# Altium project Room1.PrjPCB
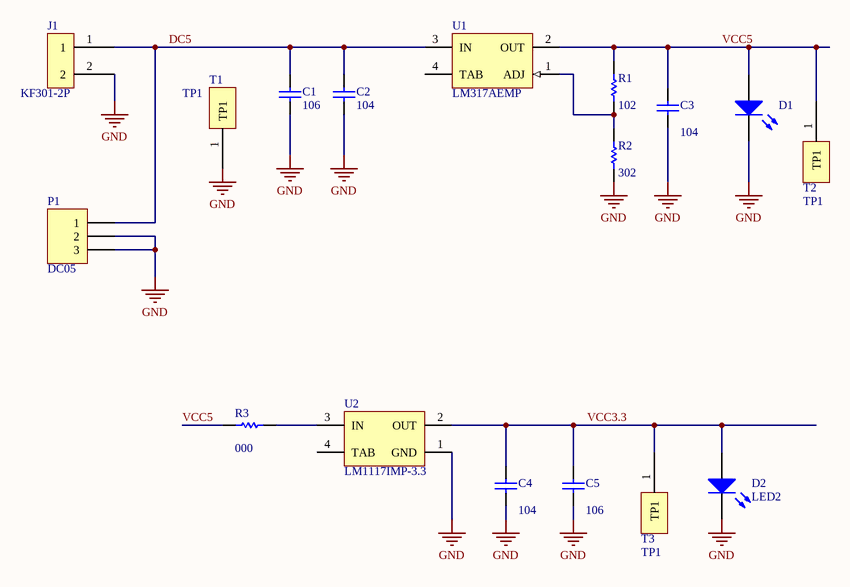
[diagram p0: Power1.SchDoc]
3 sheets, 42 parts. Net scope: global (net labels, ports and power ports of the same name join across sheets).
Board file: Room1.PcbDoc
Sheets:
  Power1.SchDoc
  STM32F103.SchDoc
  Raspi.SchDoc

## Sheet Power1.SchDoc
size A4

### Parts
C1  value 106  [CAPC3216L]  (hidden comment: Cap Semi)
C2  value 104  [CAPC3216L]  (hidden comment: Cap Semi)
C3  value 104  [CAPC3216L]  (hidden comment: Cap Semi)
C4  value 104  [CAPC3216L]  (hidden comment: Cap Semi)
C5  value 106  [CAPC3216L]  (hidden comment: Cap Semi)
D1  LED0  [CAPC2512L]  (value not drawn)
D2  LED2  [CAPC2512L]
J1  KF301-2P  [KF301-2P]
P1  DC05  [DC005]
R1  value 102  [RESC3216L]  (hidden comment: Res Semi)
R2  value 302  [RESC3216L]  (hidden comment: Res Semi)
R3  value 000  [RESC3216L]  (hidden comment: Res Semi)
T1  TP1  [TP1]
T2  TP1  [TP1]
T3  TP1  [TP1]
U1  LM317AEMP  [MP04A_L]
U2  LM1117IMP-3.3  [MP04A_N]

### Nets
GND: C1.1 C2.1 C3.1 C4.1 C5.1 D1.2(K) D2.2(K) J1.2 P1.2 P1.3 R2.1 T1.1(TP1) U2.1(GND)
DC5: C1.2 C2.2 J1.1 P1.1 U1.3(IN)
VCC3.3: C4.2 C5.2 D2.1(A) T3.1(TP1) U2.2(OUT)
VCC5: C3.2 D1.1(A) R1.2 R3.1 T2.1(TP1) U1.2(OUT)
NetR1_1: R1.1 R2.2 U1.1(ADJ)
NetR3_2: R3.2 U2.3(IN)

Not connected (* = marked no-connect by the designer): U1 4(TAB); U2 4(TAB)

### Library data of the parts
C1-C5 = Cap Semi: Capacitor (Semiconductor SIM Model); Published: 8-Jun-2000; LatestRevisionDate: 29-May-2009; LatestRevisionNote: IPC-7351 Footprint Added.; PackageReference: C1206; Publisher: Altium Limited; PackageDescription: Chip Capacitor
D1 = LED0: Typical INFRARED GaAs LED; Published: 8-Jun-2000; LatestRevisionDate: 08-Jul-2005; LatestRevisionNote: Mech Layer 1 removed.; PackageReference: LED-0; Publisher: Altium Limited
D2 = LED2: Typical RED, GREEN, YELLOW, AMBER GaAs LED; Published: 8-Jun-2000; LatestRevisionDate: 17-Jul-2002; LatestRevisionNote: Re-released for DXP Platform.; PackageVersion: Feb-2002; PackageReference: 3.2X1.6X1.1; Publisher: Altium Limited
P1 = Header 3: Header, 3-Pin; LatestRevisionDate: 17-Jul-2002; LatestRevisionNote: Re-released for DXP Platform.; Publisher: Altium Limited
R1-R3 = Res Semi: Semiconductor Resistor; Published: 8-Jun-2000; LatestRevisionDate: 17-Jul-2002; LatestRevisionNote: Re-released for DXP Platform.; PackageReference: AXIAL-0.5; Publisher: Altium Limited
U1 = LM317AEMP: 3-Terminal Adjustable Regulator; Manufacturer: National Semiconductor; CompType: LDO IC; PackageTopMarking: XYTT*N07A; PowerWise: N; Published: 4-Dec-2008; DatasheetVersion: Apr-2007; PackageVersion: revB, Apr-2003; PackageReference: MP04A; Publisher: Altium Limited; PackageDescription: Molded SOT-223, 6.50 x 3.56 x 1.6mm Body, 4 Lead, 2.3mm Pitch; PartNumber: LM317AEMP; RoHS: O; PinCount: 4; DigiKeyPartNumber: LM317AEMPCT-ND; Code_JEDEC: TO-261-AA; Code_IPC: SOT223-4; ComponentLink1Description: LM317 Datasheet; ComponentLink1URL: http://www.national.com/ds/LM/LM317.pdf; ComponentLink2Description: LM317 Web Page; ComponentLink2URL: http://www.national.com/pf/LM/LM317.html; ComponentLink3Description: MP04A Package Page; ComponentLink3URL: http://www.national.com/packaging/folders/mp04a.html
U2 = LM1117IMP-3.3: 800mA Low-Dropout Linear Regulator; Manufacturer: National Semiconductor; CompType: LDO IC; PackageTopMarking: XYTT*N05B; PowerWise: N; Published: 4-Dec-2008; DatasheetVersion: Apr-2006; PackageVersion: revB, Apr-2003; PackageReference: MP04A; Publisher: Altium Limited; PackageDescription: Molded SOT-223, 6.50 x 3.56 x 1.6mm Body, 4 Lead, 2.3mm Pitch; PartNumber: LM1117IMP-3.3; RoHS: O; PinCount: 4; DigiKeyPartNumber: LM1117IMP-3.3CT-ND; Code_JEDEC: TO-261-AA; Code_IPC: SOT223-4; ComponentLink1Description: LM1117 Datasheet; ComponentLink1URL: http://www.national.com/ds/LM/LM1117.pdf; ComponentLink2Description: LM1117 Web Page; ComponentLink2URL: http://www.national.com/pf/LM/LM1117.html; ComponentLink3Description: MP04A Package Page; ComponentLink3URL: http://www.national.com/packaging/folders/mp04a.html

## Sheet STM32F103.SchDoc
size A4
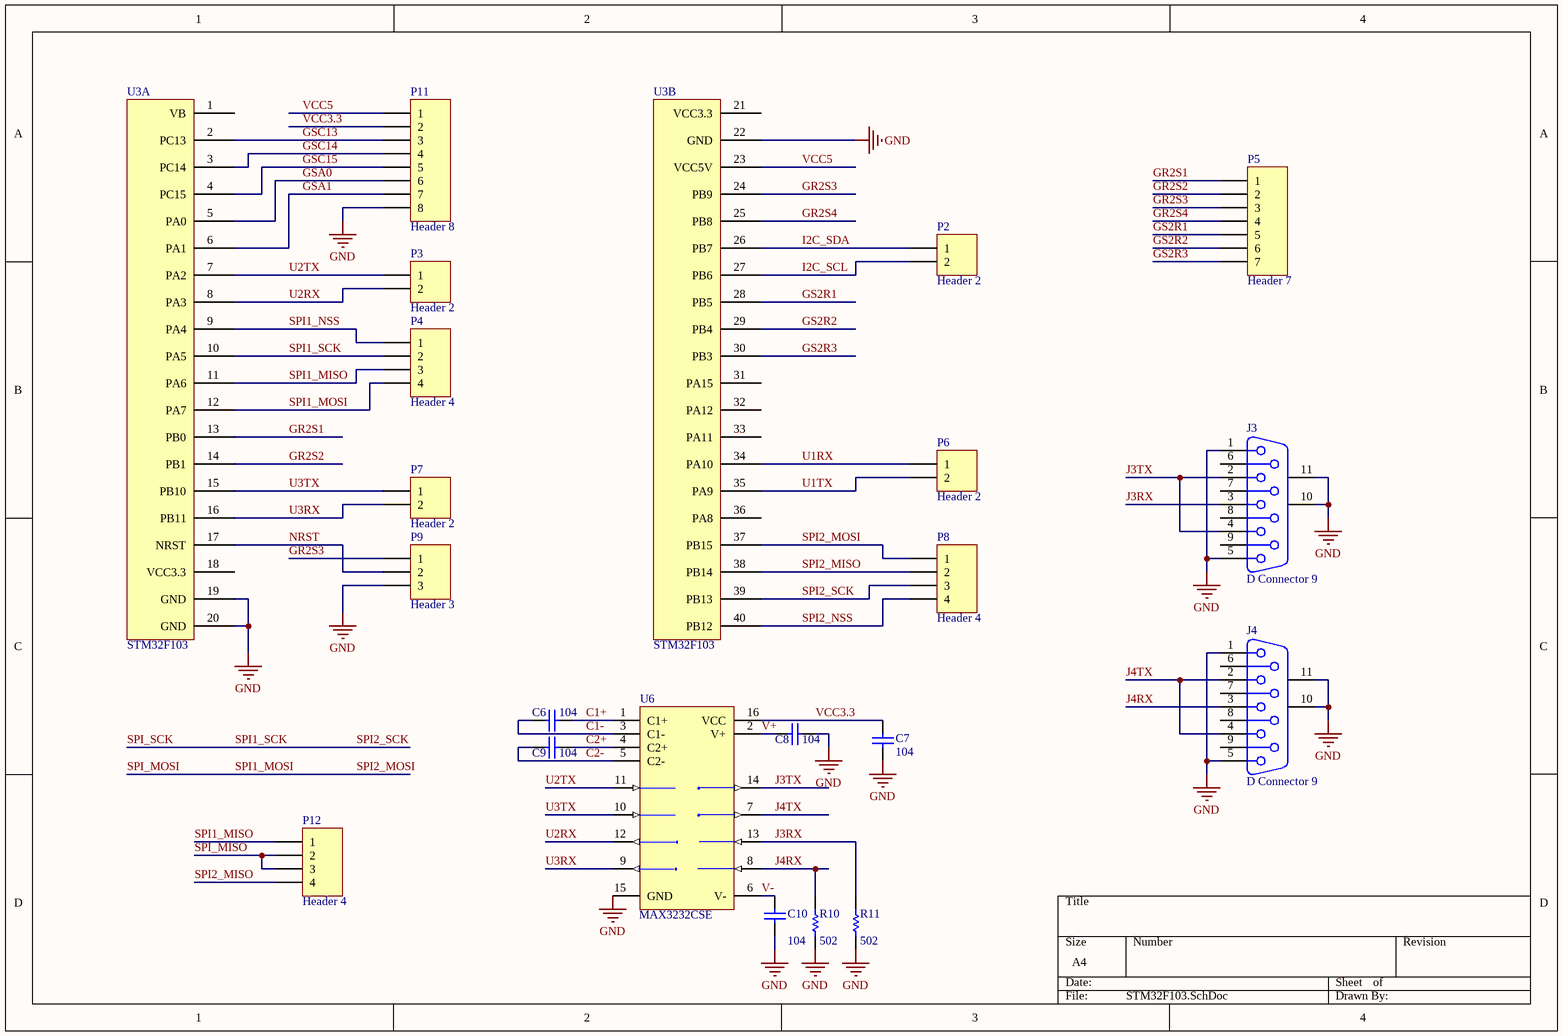
[diagram p1: STM32F103.SchDoc]

### Parts
C6  value 104  [CAPC3216L]  (hidden comment: Cap Semi)
C7  value 104  [CAPC3216L]  (hidden comment: Cap Semi)
C8  value 104  [CAPC3216L]  (hidden comment: Cap Semi)
C9  value 104  [CAPC3216L]  (hidden comment: Cap Semi)
C10  value 104  [CAPC3216L]  (hidden comment: Cap Semi)
J3  D Connector 9  [DSUB1.385-2H9]
J4  D Connector 9  [DSUB1.385-2H9]
P2  Header 2  [HDR1X2]
P3  Header 2  [HDR1X2]
P4  Header 4  [HDR1X4]
P5  Header 7  [HDR1X7]
P6  Header 2  [HDR1X2]
P7  Header 2  [HDR1X2]
P8  Header 4  [HDR1X4]
P9  Header 3  [HDR1X3]
P11  Header 8  [HDR1X8]
P12  Header 4  [HDR1X4]
R10  value 502  [RESC3216L]  (hidden comment: Res Semi)
R11  value 502  [RESC3216L]  (hidden comment: Res Semi)
U3  STM32F103  [STM32F103C8T6]  (parts A,B of 2)
U6  MAX3232CSE  [NSO16_N]

### Nets
GND: C7.2 C8.1 C10.1 J3.1 J3.5 J3.10(MH1) J3.11(MH2) J4.1 J4.5 J4.10(MH1) J4.11(MH2) P9.3 P11.8 R10.1 R11.1 U3.19(GND) U3.20(GND) U3.22(GND) U6.15(GND)
C1+: C6.1 U6.1(C1+)
C1-: C6.2 U6.3(C1-)
C2+: C9.1 U6.4(C2+)
C2-: C9.2 U6.5(C2-)
GR2S1: P5.1 U3.13(PB0)
GR2S2: P5.2 U3.14(PB1)
GR2S3: P5.3 P9.1 U3.24(PB9)
GR2S4: P5.4 U3.25(PB8)
GS2R1: P5.5 U3.28(PB5)
GS2R2: P5.6 U3.29(PB4)
GS2R3: P5.7 U3.30(PB3)
GSA0: P11.6 U3.5(PA0)
GSA1: P11.7 U3.6(PA1)
GSC13: P11.3 U3.2(PC13)
GSC14: P11.4 U3.3(PC14)
GSC15: P11.5 U3.4(PC15)
I2C_SCL: P2.2 U3.27(PB6)
I2C_SDA: P2.1 U3.26(PB7)
J3RX: J3.3 R11.2 U6.13(R1IN)
J3TX: J3.2 J3.4 U6.14(T1OUT)
J4RX: J4.3 R10.2 U6.8(R2IN)
J4TX: J4.2 J4.4 U6.7(T2OUT)
NRST: P9.2 U3.17(NRST)
SPI1_MISO: P4.3 P12.1 U3.11(PA6)
SPI1_MOSI: P4.4 P8.1 U3.12(PA7) U3.37(PB15)  [also labelled SPI2_MOSI, SPI_MOSI]
SPI1_NSS: P4.1 U3.9(PA4)
SPI1_SCK: P4.2 P8.3 U3.10(PA5) U3.39(PB13)  [also labelled SPI2_SCK, SPI_SCK]
SPI2_MISO: P8.2 P12.4 U3.38(PB14)
SPI2_NSS: P8.4 U3.40(PB12)
SPI_MISO: P12.2 P12.3
U1RX: P6.1 U3.34(PA10)
U1TX: P6.2 U3.35(PA9)
U2RX: P3.2 U3.8(PA3) U6.12(R1OUT)
U2TX: P3.1 U3.7(PA2) U6.11(T1IN)
U3RX: P7.2 U3.16(PB11) U6.9(R2OUT)
U3TX: P7.1 U3.15(PB10) U6.10(T2IN)
V+: C8.2 U6.2(V+)
V-: C10.2 U6.6(V-)
VCC3.3: C7.1 P11.2 U6.16(VCC)
VCC5: P11.1 U3.23(VCC5V)

Not connected (* = marked no-connect by the designer): J3 6 7 8 9; J4 6 7 8 9; U3 1(VB) 18(VCC3.3) 21(VCC3.3) 31(PA15) 32(PA12) 33(PA11) 36(PA8)

### Library data of the parts
C6-C10 = Cap Semi: Capacitor (Semiconductor SIM Model); Published: 8-Jun-2000; LatestRevisionDate: 29-May-2009; LatestRevisionNote: IPC-7351 Footprint Added.; PackageReference: C1206; Publisher: Altium Limited; PackageDescription: Chip Capacitor
J3 J4 = D Connector 9: Receptacle Assembly, 9 Position, Right Angle; PackageDocument: O; Positions: 9; Published: 15-Jun-2001; LatestRevisionDate: 17-Jul-2002; LatestRevisionNote: Re-released for DXP Platform.; DatasheetDocument: 1-Sep-1999; PackageReference: 788750; Publisher: Altium Limited; Orientation: Right Angle; Gender: Receptacle
P2 P3 P6 P7 = Header 2: Header, 2-Pin; LatestRevisionDate: 17-Jul-2002; LatestRevisionNote: Re-released for DXP Platform.; Publisher: Altium Limited
P4 P8 P12 = Header 4: Header, 4-Pin; LatestRevisionDate: 17-Jul-2002; LatestRevisionNote: Re-released for DXP Platform.; Publisher: Altium Limited
P5 = Header 7: Header, 7-Pin; LatestRevisionDate: 17-Jul-2002; LatestRevisionNote: Re-released for DXP Platform.; Publisher: Altium Limited
P9 = Header 3: Header, 3-Pin; LatestRevisionDate: 17-Jul-2002; LatestRevisionNote: Re-released for DXP Platform.; Publisher: Altium Limited
P11 = Header 8: Header, 8-Pin; LatestRevisionDate: 17-Jul-2002; LatestRevisionNote: Re-released for DXP Platform.; Publisher: Altium Limited
R10 R11 = Res Semi: Semiconductor Resistor; Published: 8-Jun-2000; LatestRevisionDate: 17-Jul-2002; LatestRevisionNote: Re-released for DXP Platform.; PackageReference: AXIAL-0.5; Publisher: Altium Limited
U3 = STM32F103C8T6
U6 = MAX3232CSE: 3.0V TO 5.5V, Low-Power, up to 1Mbps, True RS-232 Transceiver Using Four 0.1µF External Capacitor; Published: 16-Jan-2001; LatestRevisionDate: 13-Apr-2006; LatestRevisionNote: IPC-7351 Footprint Added.; DatasheetVersion: Mar-1999; PackageReference: NSO16; Publisher: Altium Limited; PackageDescription: 16-Pin Small Outline Integrated Circuit 1.27 mm Pitch; Code_JEDEC: MS-012-AC; Code_IPC: SOIC127P600-16; ComponentLink1Description: Manufacturer Link; ComponentLink1URL: http://www.maxim-ic.com/; ComponentLink2Description: Datasheet; ComponentLink2URL: http://pdfserv.maxim-ic.com/en/ds/MAX3222-MAX3241.pdf

## Sheet Raspi.SchDoc
size A4
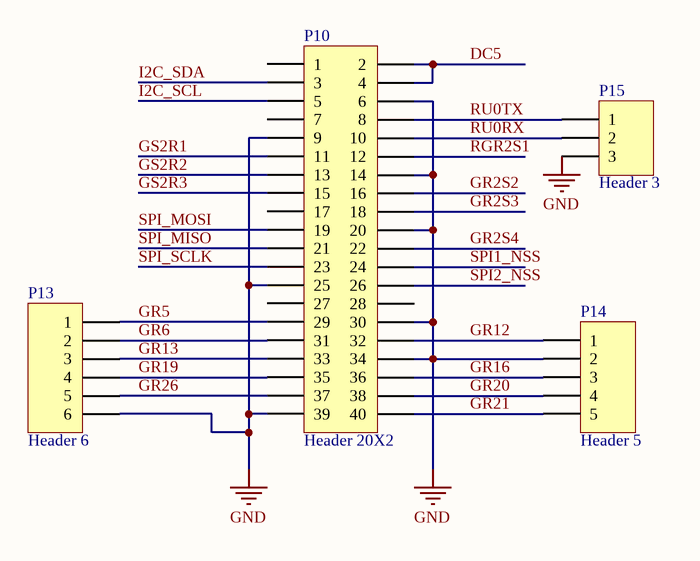
[diagram p2: Raspi.SchDoc]

### Parts
P10  Header 20X2  [HDR2X20]
P13  Header 6  [HDR1X6]
P14  Header 5  [HDR1X5]
P15  Header 3  [HDR1X3]

### Nets
GND: P10.6 P10.9 P10.14 P10.20 P10.25 P10.30 P10.34 P10.39 P13.6 P14.2 P15.3
DC5: P10.2 P10.4
GR2S2: P10.16
GR2S3: P10.18
GR2S4: P10.22
GR5: P10.29 P13.1
GR6: P10.31 P13.2
GR12: P10.32 P14.1
GR13: P10.33 P13.3
GR16: P10.36 P14.3
GR19: P10.35 P13.4
GR20: P10.38 P14.4
GR21: P10.40 P14.5
GR26: P10.37 P13.5
GS2R1: P10.11
GS2R2: P10.13
GS2R3: P10.15
I2C_SCL: P10.5
I2C_SDA: P10.3
RGR2S1: P10.12
RU0RX: P10.10 P15.2
RU0TX: P10.8 P15.1
SPI1_NSS: P10.24
SPI2_NSS: P10.26
SPI_MISO: P10.21
SPI_MOSI: P10.19  [project net SPI1_MOSI]
SPI_SCLK: P10.23

Not connected (* = marked no-connect by the designer): P10 1 7 17 27 28

### Library data of the parts
P10 = Header 20X2: Header, 20-Pin, Dual row; LatestRevisionDate: 17-Jul-2002; LatestRevisionNote: Re-released for DXP Platform.; Publisher: Altium Limited
P13 = Header 6: Header, 6-Pin; LatestRevisionDate: 17-Jul-2002; LatestRevisionNote: Re-released for DXP Platform.; Publisher: Altium Limited
P14 = Header 5: Header, 5-Pin; LatestRevisionDate: 17-Jul-2002; LatestRevisionNote: Re-released for DXP Platform.; Publisher: Altium Limited
P15 = Header 3: Header, 3-Pin; LatestRevisionDate: 17-Jul-2002; LatestRevisionNote: Re-released for DXP Platform.; Publisher: Altium Limited

## Nets that join several sheets
GND: Power1 (13 pins), STM32F103 (19 pins), Raspi (11 pins)
DC5: Power1 (5 pins), Raspi (P10.2 P10.4)
GR2S2: STM32F103 (P5.2 U3.14), Raspi (P10.16)
GR2S3: STM32F103 (P5.3 P9.1 U3.24), Raspi (P10.18)
GR2S4: STM32F103 (P5.4 U3.25), Raspi (P10.22)
GS2R1: STM32F103 (P5.5 U3.28), Raspi (P10.11)
GS2R2: STM32F103 (P5.6 U3.29), Raspi (P10.13)
GS2R3: STM32F103 (P5.7 U3.30), Raspi (P10.15)
I2C_SCL: STM32F103 (P2.2 U3.27), Raspi (P10.5)
I2C_SDA: STM32F103 (P2.1 U3.26), Raspi (P10.3)
SPI1_MOSI: STM32F103 (P4.4 P8.1 U3.12 U3.37), Raspi (P10.19)
SPI1_NSS: STM32F103 (P4.1 U3.9), Raspi (P10.24)
SPI2_NSS: STM32F103 (P8.4 U3.40), Raspi (P10.26)
SPI_MISO: STM32F103 (P12.2 P12.3), Raspi (P10.21)
VCC3.3: Power1 (5 pins), STM32F103 (C7.1 P11.2 U6.16)
VCC5: Power1 (6 pins), STM32F103 (P11.1 U3.23)